# EAGLE design clockwork-backpack-1a5 (EAGLE 9.6.2)
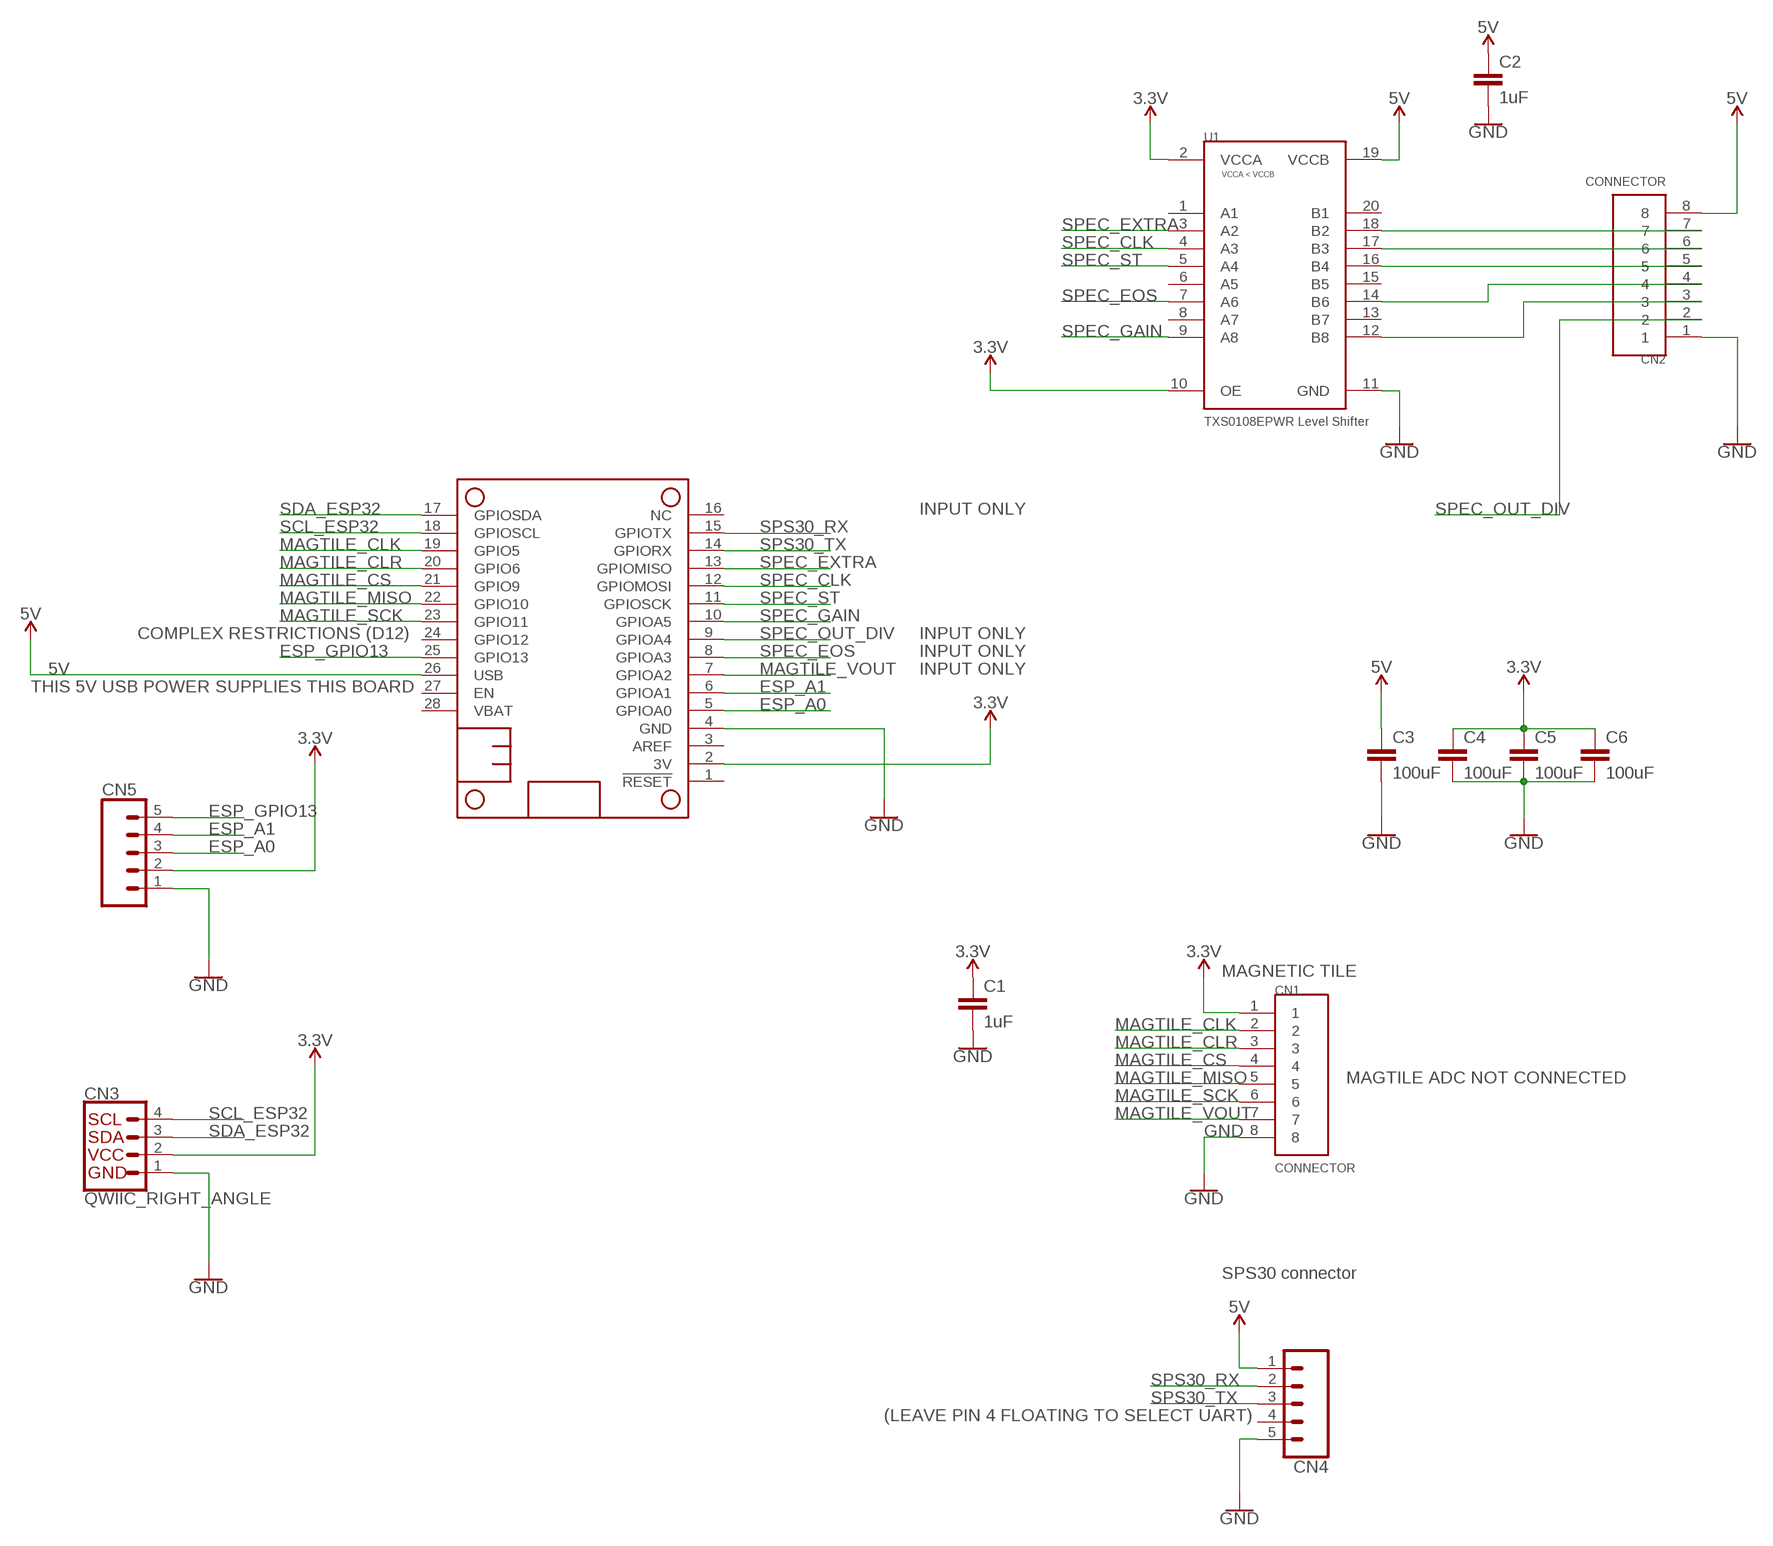
[diagram p0: schematic, sheet 1]

## Parts
C1  1uF  CAP-0603  [0603]
C2  1uF  CAP-0603  [0603]
C3  100uF  CAP-1206  [1206]
C4  100uF  CAP-1206  [1206]
C5  100uF  CAP-1206  [1206]
C6  100uF  CAP-1206  [1206]
CN1  CON-SM08B-SRSS-TB  [CON-SM08B-SRSS-TB]
CN2  CON-SM08B-SRSS-TB  [CON-SM08B-SRSS-TB]
CN3  QWIIC_RIGHT_ANGLE  QWIIC_CONNECTORJS-1MM  [JST04_1MM_RA]
CN4  CONN_05LOCK  [1X05_LOCK]
CN5  CONN_05LOCK  [1X05_LOCK]
U1  TXS0108EPWR  [TSSOP-20]
U2  FEATHERWING_NODIM  [FEATHERWING_DIM]

## Nets
3.3V: C1.1 C4.1 C5.1 C6.1 CN1.1 CN3.2 CN5.2 U1.2(VCCA) U1.10(OE) U2.2(3V)
5V: C2.1 C3.1 CN2.8 CN4.1 U1.19(VCCB) U2.26(USB)
ESP_A0: CN5.3 U2.5(GPIOA0)
ESP_A1: CN5.4 U2.6(GPIOA1)
ESP_GPIO13: CN5.5 U2.25(GPIO13)
GND: C1.2 C2.2 C3.2 C4.2 C5.2 C6.2 CN1.8 CN2.1 CN3.1 CN4.5 CN5.1 U1.11(GND) U2.4(GND)
MAGTILE_CLK: CN1.2 U2.19(GPIO5)
MAGTILE_CLR: CN1.3 U2.20(GPIO6)
MAGTILE_CS: CN1.4 U2.21(GPIO9)
MAGTILE_MISO: CN1.5 U2.22(GPIO10)
MAGTILE_SCK: CN1.6 U2.23(GPIO11)
MAGTILE_VOUT: CN1.7 U2.7(GPIOA2)
N$5: CN2.7 U1.18(B2)
N$8: CN2.3 U1.12(B8)
N$9: CN2.4 U1.14(B6)
N$11: CN2.6 U1.17(B3)
N$12: CN2.5 U1.16(B4)
SCL_ESP32: CN3.4 U2.18(GPIOSCL)
SDA_ESP32: CN3.3 U2.17(GPIOSDA)
SPEC_CLK: U1.4(A3) U2.12(GPIOMOSI)
SPEC_EOS: U1.7(A6) U2.8(GPIOA3)
SPEC_EXTRA: U1.3(A2) U2.13(GPIOMISO)
SPEC_GAIN: U1.9(A8) U2.10(GPIOA5)
SPEC_OUT_DIV: CN2.2 U2.9(GPIOA4)
SPEC_ST: U1.5(A4) U2.11(GPIOSCK)
SPS30_RX: CN4.2 U2.15(GPIOTX)
SPS30_TX: CN4.3 U2.14(GPIORX)
Unconnected: CN4.4 U1.1(A1) U1.6(A5) U1.8(A7) U1.13(B7) U1.15(B5) U1.20(B1) U2.1(!RESET) U2.3(AREF) U2.16(NC) U2.24(GPIO12) U2.27(EN) U2.28(VBAT)

## Notes on the sheet
- INPUT ONLY
- COMPLEX RESTRICTIONS (D12) | INPUT ONLY
- INPUT ONLY
- INPUT ONLY
- THIS 5V USB POWER SUPPLIES THIS BOARD
- MAGNETIC TILE
- MAGTILE ADC NOT CONNECTED
- SPS30 connector
- (LEAVE PIN 4 FLOATING TO SELECT UART)

## Library data of the parts
C1-C6 = SparkFun-Capacitors:CAP
CN1 CN2 = notes1a:CON-SM08B-SRSS-TB
CN3 = SparkFun-Connectors:QWIIC_CONNECTOR: SparkFun I2C Standard Qwiic Connector An SMD 1mm pitch JST connector makes it easy and quick (get it? Qwiic?) to connect I2C devices to each other. The Qwiic system <http://www.sparkfun.com/qwiic> enables fast and solderless connection between popular platforms and various sensors and actuators. We carry 200mm <https://www.sparkfun.com/products/14204>, 100mm <https://www.sparkfun.com/products/14205>, 50mm <https://www.sparkfun.com/products/14206>, and breadboard friendly <https://www.sparkfun.com/products/14207> Qwiic cables. We also offer 10 pcs strips <https://www.sparkfun.com/products/14323> the SMD connectors.; PROD_ID: CONN-13694
CN4 CN5 = SparkFun-Connectors:CONN_05: Multi connection point. Often used as Generic Header-pin footprint for 0.1 inch spaced/style header connections On any of the 0.1 inch spaced packages, you can populate with these: Break Away Headers - Straight <https://www.sparkfun.com/products/116> (PRT-00116) Break Away Male Headers - Right Angle <https://www.sparkfun.com/products/553> (PRT-00553) Female Headers <https://www.sparkfun.com/products/115> (PRT-00115) Break Away Headers - Machine Pin <https://www.sparkfun.com/products/117> (PRT-00117) Break Away Female Headers - Swiss Machine Pin <https://www.sparkfun.com/products/743> (PRT-00743) For SCREWTERMINALS and SPRING TERMINALS visit here: Screw Terimnals on SparkFun.com <https://www.sparkfun.com/search/results?term=Screw+Terminals> (5mm/3.5mm/2.54mm spacing) This device is also useful as a general connection point to wire up your design to another part of your project. Our various solder wires solder well into these plated through hole pads. Hook-Up Wire - Assortment (Stranded, 22 AWG) <https://www.sparkfun.com/products/11375> (PRT-11375) Hook-Up Wire - Assortment (Solid Core, 22 AWG) <https://www.sparkfun.com/products/11367> (PRT-11367) View the entire wire category on our website here <https://www.sparkfun.com/categories/141> Special notes: Molex polarized connector foot print use with SKU : PRT-08231 with associated crimp pins and housings. 1MM SMD Version SKU: PRT-10208
U1 = notes1a:TXS0108EPWR: TXS0108EPWR 3.3V -> 5V bidirectional level shifter
U2 = notes1a:FEATHERWING

## Board
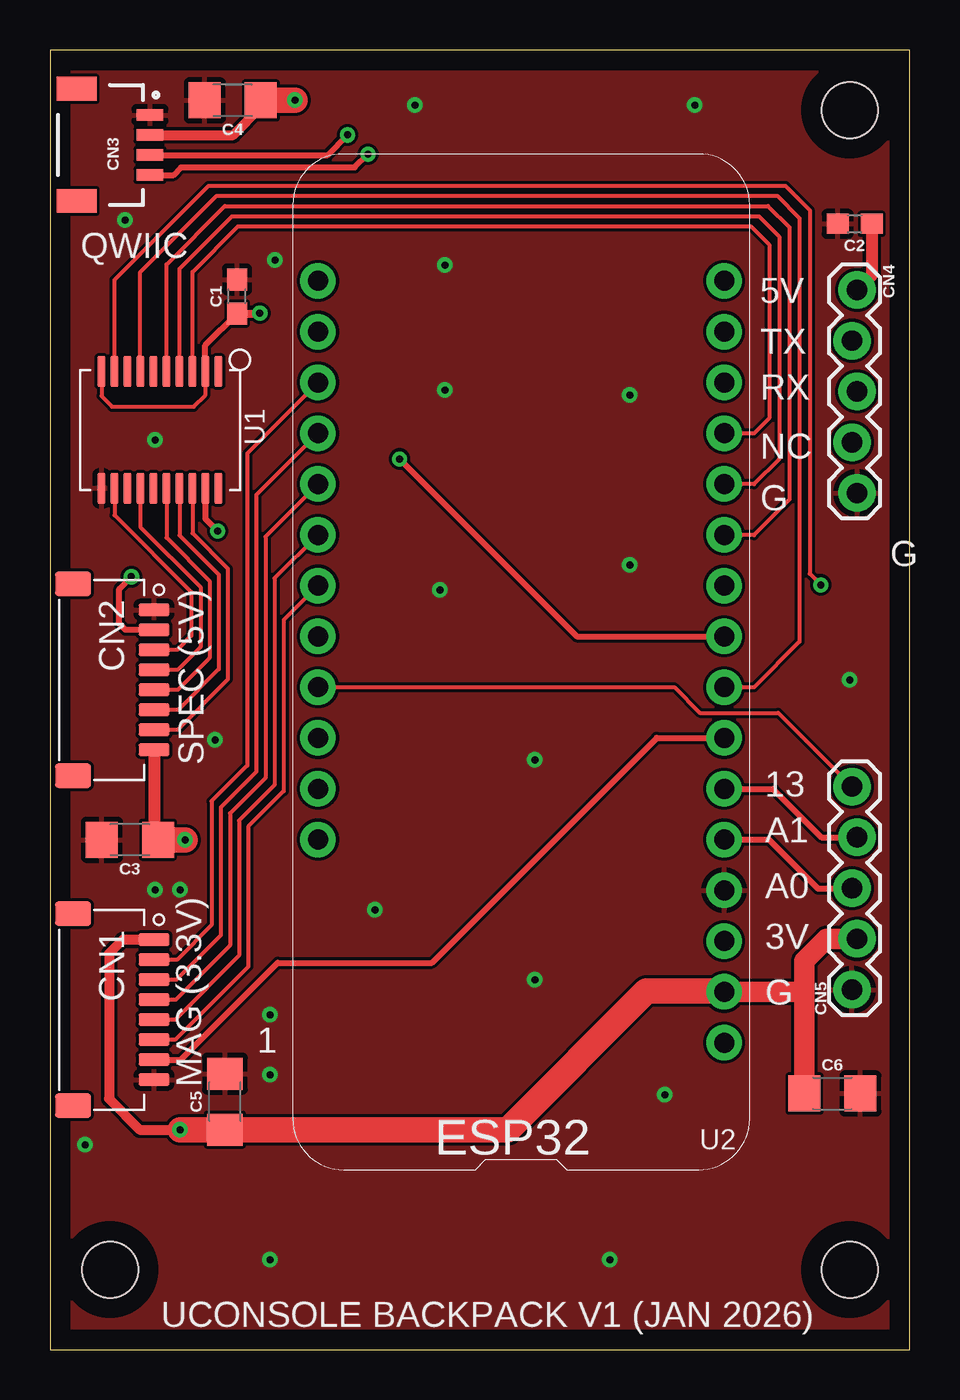
[diagram p1: board, top side]
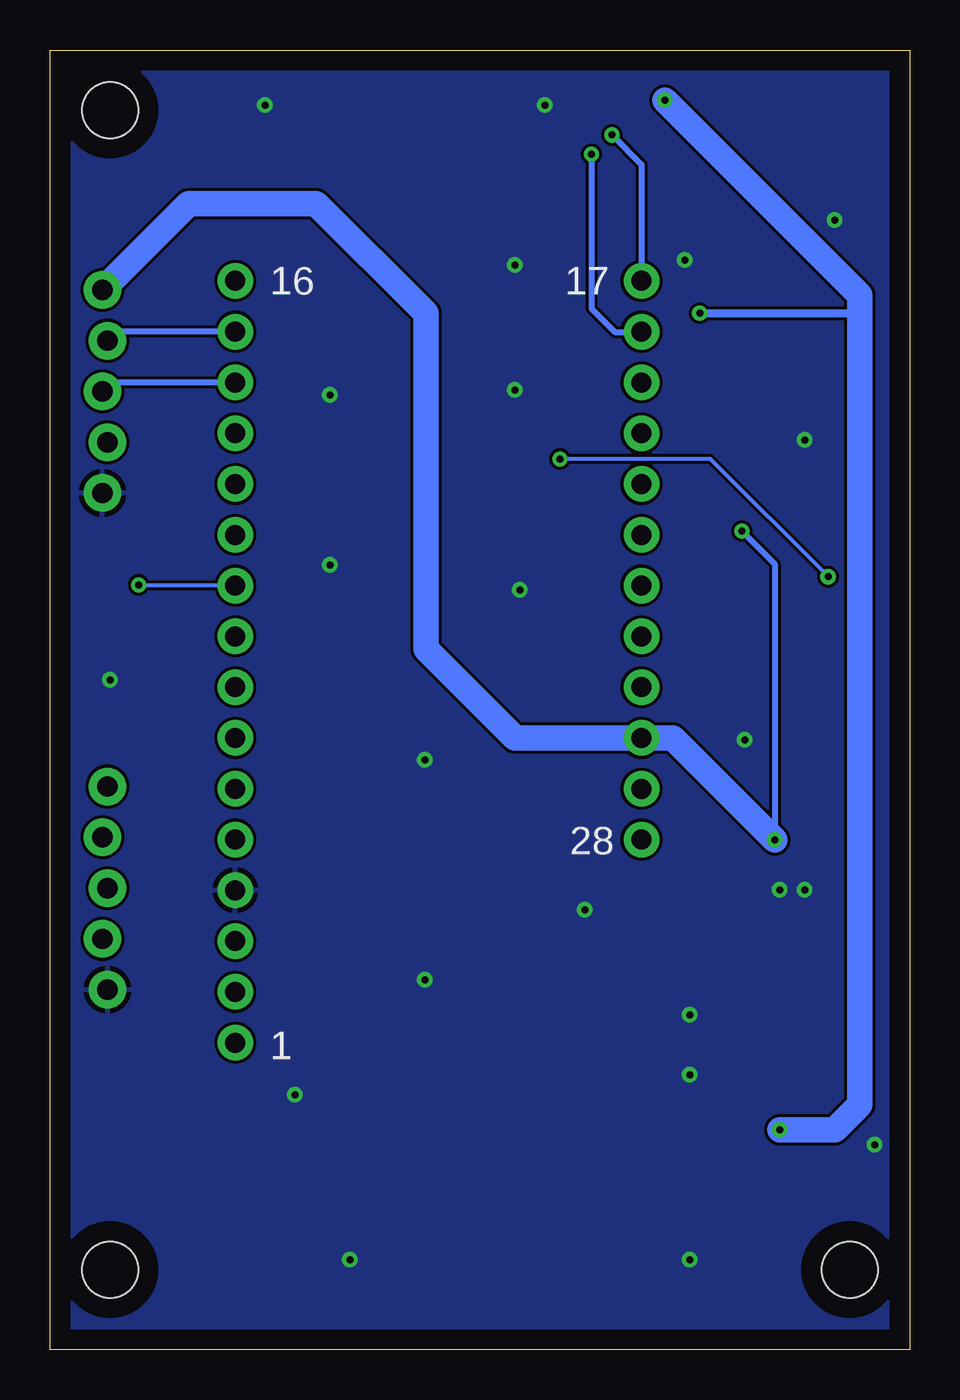
[diagram p2: board, bottom side, seen from below]

Size 43 x 65 mm. Coordinates in mm from the lower left corner, seen from the top.
Outline: 0,0 43,0 43,65 0,65 0,0
Copper layers (1*16): Top 0.035mm / dielectric 1.5mm / Bottom 0.035mm
Design rules "default": minimum track width 6mil, minimum drill 0.35mm, track to track 6mil, track to pad 6mil, pad to pad 6mil, via to via 6mil, smd to smd 6mil, copper to edge 40mil, drill to drill 6mil, minimum pad ring 10mil, minimum via ring 8mil, stop-mask expansion 4mil, vias tented up to drill 0mil, thermal gap 10mil
Holes 2.8 mm at 40,62 40,4 3,4

### Footprints (pad centres in the part's own frame; a part is rotated, then mirrored left to right if it is on the bottom)
0603 = smd 1.1 x 1: 1 -0.85,0; 2 0.85,0
1206 = smd 1.6 x 1.8: 1 -1.4,0; 2 1.4,0
CON-SM08B-SRSS-TB = smd 0.6 x 1.55: 1 -3.5,2.21; 2 -2.5,2.21; 3 -1.5,2.21; 4 -0.5,2.21; 5 0.5,2.21; 6 1.5,2.21; 7 2.5,2.21; 8 3.5,2.21 | smd 1.2 x 1.8: PAD1 -4.8,-1.84; PAD2 4.8,-1.84
JST04_1MM_RA = smd 0.6 x 1.35: 1 -1.5,0; 2 -0.5,0; 3 0.5,0; 4 1.5,0 | smd 1.2 x 2: NC1 2.8,-3.675; NC2 -2.8,-3.675
1X05_LOCK = drill 1.016 pad 1.88: 1 0,0.127; 2 2.54,-0.127; 3 5.08,0.127; 4 7.62,-0.127; 5 10.16,0.127
TSSOP-20 = smd 1.5 x 0.4: 1 -2.925,2.925; 2 -2.925,2.275; 3 -2.925,1.625; 4 -2.925,0.975; 5 -2.925,0.325; 6 -2.925,-0.325; 7 -2.925,-0.975; 8 -2.925,-1.625; 9 -2.925,-2.275; 10 -2.925,-2.925; 11 2.925,-2.925; 12 2.925,-2.275; 13 2.925,-1.625; 14 2.925,-0.975; 15 2.925,-0.325; 16 2.925,0.325; 17 2.925,0.975; 18 2.925,1.625; 19 2.925,2.275; 20 2.925,2.925
FEATHERWING_DIM = drill 1 pad 1.778: 1 6.35,1.27; 2 8.89,1.27; 3 11.43,1.27; 4 13.97,1.27; 5 16.51,1.27; 6 19.05,1.27; 7 21.59,1.27; 8 24.13,1.27; 9 26.67,1.27; 10 29.21,1.27; 11 31.75,1.27; 12 34.29,1.27; 13 36.83,1.27; 14 39.37,1.27; 15 41.91,1.27; 16 44.45,1.27; 17 44.45,21.59; 18 41.91,21.59; 19 39.37,21.59; 20 36.83,21.59; 21 34.29,21.59; 22 31.75,21.59; 23 29.21,21.59; 24 26.67,21.59; 25 24.13,21.59; 26 21.59,21.59; 27 19.05,21.59; 28 16.51,21.59

### Placement (x,y rotation side)
C1  9.36,52.67 90 top
C2  40.25,56.3 180 top
C3  4,25.5 180 top
C4  9.14,62.49 180 top
C5  8.75,12.4 90 top
C6  39.14,12.8 0 top
CN1  3,17 270 top
CN2  3,33.5 270 top
CN3  5,60.25 270 top
CN4  40.25,53 270 top
CN5  40.25,18 90 top
U1  5.5,46 270 top
U2  35,9 90 top

### Tracks (layer width: path | path; a pad name or v marks a point on that pad's centre or on a via)
3.3V  (via drill 0.35)
  Top 0.203: U1.10 2.58,47.7 3.11,47.16 7.2,47.16 7.78,47.75 U1.2
  Top 0.305: U1.2 7.77,50.24 C1.1
  Top 0.406: C1.1 10.46,51.82 10.47,51.81 v10.5,51.84
  Top 0.508: CN1.1 3.65,20.5 2.95,19.81 2.95,12.54 4.5,11 v6.5,11 | CN3.2 9.15,60.75 10.56,62.16 10.56,62.5
  Top 1.016: C6.1 37.74,17.77 | 37.74,17.77 37.74,19.44 38.84,20.54 CN5.2 | U2.2 37.62,17.89 37.74,17.77
  Top 1.27: U2.2 33.69,17.93 29.83,17.93 22.9,11 C5.1 v6.5,11 | C4.1 10.56,62.5 v12.25,62.5
  Bottom 0.406: v10.5,51.84 2.52,51.84 2.5,51.86
  Bottom 1.27: v12.25,62.5 2.5,52.75 2.5,51.86 2.5,12.25 3.75,11 v6.5,11
5V  (via drill 0.35)
  Top 0.305: U1.19 7.77,41.55 v8.39,40.94
  Top 0.61: CN2.8 5.21,25.69 C3.1 | C2.1 41.1,53.73 CN4.1
  Top 1.27: v6.75,25.5 C3.1
  Bottom 0.305: v8.39,40.94 6.75,39.3 v6.75,25.5
  Bottom 1.27: v6.75,25.5 11.84,30.59 U2.26 19.73,30.59 24.19,35.05 24.19,51.84 29.68,57.32 36.06,57.32 CN4.1
ESP_A0
  Top 0.305: U2.5 35.96,25.51 38.41,23.06 40.1,23.06 CN5.3
ESP_A1
  Top 0.305: U2.6 36.16,28.05 38.59,25.62 CN5.4
ESP_GPIO13
  Top 0.203: U2.25 31.24,33.13 32.52,31.85 36.44,31.85 CN5.5
GND  (via drill 0.35)
  other vias: 5.25,23 6.5,23 11,16.75 11,13.75 30.75,12.75 24.25,18.5 16.25,22 24.25,29.5 40,33.5 29,39.25 19.5,38 8.25,30.5 5.25,45.5 19.75,48 29,47.75 19.75,54.25 3.75,56.5 11.25,54.5 18.25,62.25 32.25,62.25 1.75,10.25 11,4.5 28,4.5
  pour Top: 0,0 0,65 43,65 43,0
  pour Bottom: 0,0 0,65 43,65 43,0
MAGTILE_CLK
  Top 0.203: U2.19 9.86,44.82 9.86,29.2 8.09,27.43 8.09,21.23 6.36,19.5 CN1.2
MAGTILE_CLR
  Top 0.203: U2.20 10.32,42.74 10.32,28.9 8.54,27.12 8.54,20.72 6.32,18.5 CN1.3
MAGTILE_CS
  Top 0.203: U2.21 10.78,40.66 10.78,28.59 9,26.82 9,20.21 6.29,17.5 CN1.4
MAGTILE_MISO
  Top 0.203: U2.22 11.24,38.58 11.24,28.24 9.46,26.46 9.46,19.7 6.25,16.5 CN1.5
MAGTILE_SCK
  Top 0.203: U2.23 11.69,36.49 11.69,27.93 9.91,26.16 9.91,19.15 6.26,15.49 5.22,15.49 CN1.6
MAGTILE_VOUT
  Top 0.305: CN1.7 6.54,14.5 11.39,19.35 19.11,19.35 30.35,30.59 U2.7
N$5
  Top 0.203: U1.18 7.12,40.83 8.9,39.06 8.9,33.52 6.38,31 CN2.7
N$8
  Top 0.203: U1.12 3.23,41.74 7.07,37.89 7.07,35.71 6.36,35 CN2.3
N$9
  Top 0.203: U1.14 4.52,41.15 7.53,38.15 7.53,35.15 6.38,34 CN2.4
N$11
  Top 0.203: U1.17 6.48,40.72 8.44,38.76 8.44,34.03 6.41,32 CN2.6
N$12
  Top 0.203: U1.16 5.83,40.61 7.98,38.45 7.98,34.59 6.4,33 CN2.5
SCL_ESP32  (via drill 0.35)
  Top 0.305: CN3.4 6.19,58.75 6.56,59.13 15.25,59.13 v15.91,59.79
  Bottom 0.305: v15.91,59.79 15.91,52.06 14.74,50.9 13.42,50.9 U2.18
SDA_ESP32  (via drill 0.35)
  Top 0.305: CN3.3 13.89,59.75 v14.89,60.75
  Bottom 0.305: v14.89,60.75 13.41,59.27 U2.17
SPEC_CLK
  Top 0.203: U1.4 6.48,54.06 9.1,56.69 35.47,56.69 36.48,55.67 36.48,44.55 35.21,43.28 33.74,43.28 U2.12
SPEC_EOS
  Top 0.203: U1.7 4.52,53.89 8.34,57.7 36.38,57.7 37.5,56.59 37.5,35.4 35.21,33.12 33.74,33.12 U2.8
SPEC_EXTRA
  Top 0.203: U1.3 7.12,53.9 9.41,56.18 35.06,56.18 35.97,55.27 35.97,46.58 35.21,45.82 33.74,45.82 U2.13
SPEC_GAIN  (via drill 0.35)
  Top 0.203: U1.9 3.23,53.5 7.93,58.21 36.79,58.21 38.01,56.99 38.01,38.81 v38.57,38.25
  Bottom 0.203: v38.57,38.25 33.77,38.25 U2.10
SPEC_OUT_DIV  (via drill 0.35)
  Top 0.305: CN2.2 3.78,36 3.46,36.32 3.46,38.04 v4.07,38.65 | v17.48,44.55 26.36,35.67 U2.9
  Bottom 0.203: v4.07,38.65 9.97,44.55 v17.48,44.55
SPEC_ST
  Top 0.203: U1.5 5.83,54.27 8.75,57.2 35.92,57.2 36.99,56.13 36.99,42.51 35.21,40.74 33.74,40.74 U2.11
SPS30_RX
  Bottom 0.305: U2.15 39.67,50.91 CN4.2
SPS30_TX
  Bottom 0.305: U2.14 39.93,48.37 CN4.3

### Text on the board
tPlace: QWIIC | 5V | TX | RX | U1 | NC | G | G | SPEC (5V) | 13 | A1 | A0 | 3V | G | 1 | MAG (3.3V) | ESP32 | U2 | UCONSOLE BACKPACK V1 (JAN 2026)
bPlace: 17 | 16 | 28 | 1